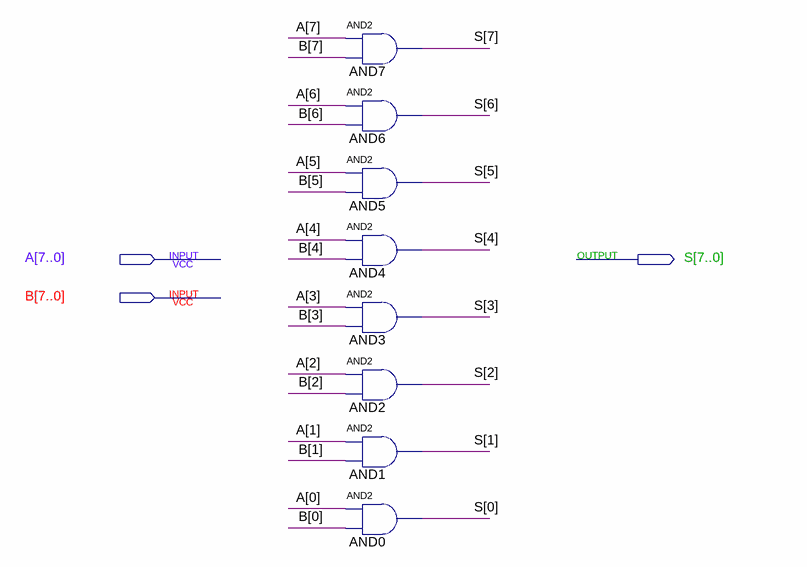
[diagram p0: schematic sheet]
// Quartus schematic AND_8b.bdf as structural Verilog: 8 symbols, 3 pins
module AND_8b (
  input  [7:0] A,
  input  [7:0] B,
  output [7:0] S
);

  and AND7 (S[7], A[7], B[7]);
  and AND6 (S[6], A[6], B[6]);
  and AND5 (S[5], A[5], B[5]);
  and AND4 (S[4], A[4], B[4]);
  and AND3 (S[3], A[3], B[3]);
  and AND2 (S[2], A[2], B[2]);
  and AND1 (S[1], A[1], B[1]);
  and AND0 (S[0], A[0], B[0]);
endmodule
